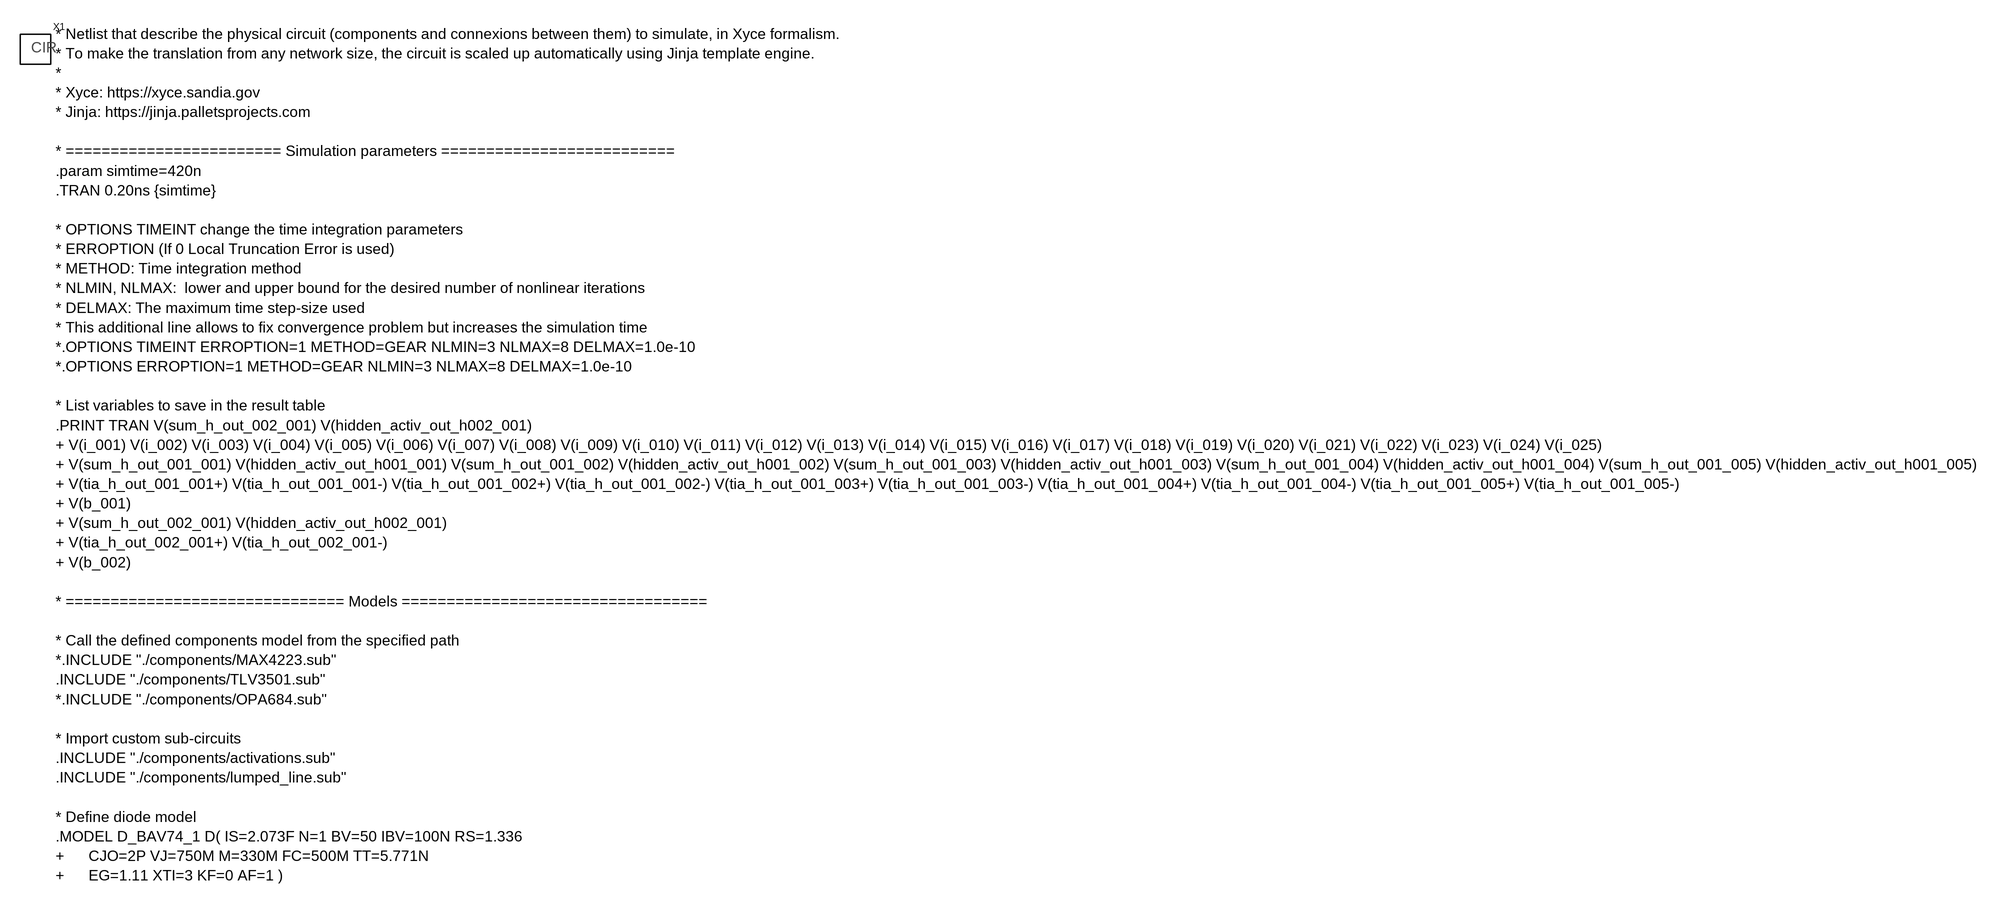
[diagram p0: schematic Draft1.asc]
Draft1.asc, the LTspice schematic file:
Version 4
SHEET 1 2360 680
SYMBOL netlist 928 -224 R0
SYMATTR InstName X1
TEXT 960 -248 Left 0 !* Netlist that describe the physical circuit (components and connexions between them) to simulate, in Xyce formalism.\n* To make the translation from any network size, the circuit is scaled up automatically using Jinja template engine.\n*\n* Xyce: https://xyce.sandia.gov\n* Jinja: https://jinja.palletsprojects.com\n \n* ======================== Simulation parameters ==========================\n.param simtime=420n\n.TRAN 0.20ns {simtime}\n \n* OPTIONS TIMEINT change the time integration parameters\n* ERROPTION (If 0 Local Truncation Error is used)\n* METHOD: Time integration method\n* NLMIN, NLMAX:  lower and upper bound for the desired number of nonlinear iterations\n* DELMAX: The maximum time step-size used\n* This additional line allows to fix convergence problem but increases the simulation time\n*.OPTIONS TIMEINT ERROPTION=1 METHOD=GEAR NLMIN=3 NLMAX=8 DELMAX=1.0e-10\n*.OPTIONS ERROPTION=1 METHOD=GEAR NLMIN=3 NLMAX=8 DELMAX=1.0e-10\n \n* List variables to save in the result table\n.PRINT TRAN V(sum_h_out_002_001) V(hidden_activ_out_h002_001)\n+ V(i_001) V(i_002) V(i_003) V(i_004) V(i_005) V(i_006) V(i_007) V(i_008) V(i_009) V(i_010) V(i_011) V(i_012) V(i_013) V(i_014) V(i_015) V(i_016) V(i_017) V(i_018) V(i_019) V(i_020) V(i_021) V(i_022) V(i_023) V(i_024) V(i_025)\n+ V(sum_h_out_001_001) V(hidden_activ_out_h001_001) V(sum_h_out_001_002) V(hidden_activ_out_h001_002) V(sum_h_out_001_003) V(hidden_activ_out_h001_003) V(sum_h_out_001_004) V(hidden_activ_out_h001_004) V(sum_h_out_001_005) V(hidden_activ_out_h001_005)\n+ V(tia_h_out_001_001+) V(tia_h_out_001_001-) V(tia_h_out_001_002+) V(tia_h_out_001_002-) V(tia_h_out_001_003+) V(tia_h_out_001_003-) V(tia_h_out_001_004+) V(tia_h_out_001_004-) V(tia_h_out_001_005+) V(tia_h_out_001_005-)\n+ V(b_001)\n+ V(sum_h_out_002_001) V(hidden_activ_out_h002_001)\n+ V(tia_h_out_002_001+) V(tia_h_out_002_001-)\n+ V(b_002)\n \n* =============================== Models ==================================\n \n* Call the defined components model from the specified path\n*.INCLUDE "./components/MAX4223.sub"\n.INCLUDE "./components/TLV3501.sub"\n*.INCLUDE "./components/OPA684.sub"\n \n* Import custom sub-circuits\n.INCLUDE "./components/activations.sub"\n.INCLUDE "./components/lumped_line.sub"\n \n* Define diode model\n.MODEL D_BAV74_1 D( IS=2.073F N=1 BV=50 IBV=100N RS=1.336\n+      CJO=2P VJ=750M M=330M FC=500M TT=5.771N\n+      EG=1.11 XTI=3 KF=0 AF=1 )

The netlist it stands for:
* Draft1.asc
XX1 "C:\Users\Hussein\UDeM\OneDrive - USherbrooke\circuits\XYCE\simulations\ActivationFunction\Sigmoid4_HA\LTspice-cli-master\LTspice-cli-master\test\netlist_copy.cir" crossbarTest crossbarTest
* Netlist that describe the physical circuit (components and connexions between them) to simulate, in Xyce formalism.
* To make the translation from any network size, the circuit is scaled up automatically using Jinja template engine.
*
* Xyce: https://xyce.sandia.gov
* Jinja: https://jinja.palletsprojects.com
* ======================== Simulation parameters ==========================
.param simtime=420n
.TRAN 0.20ns {simtime}
* OPTIONS TIMEINT change the time integration parameters
* ERROPTION (If 0 Local Truncation Error is used)
* METHOD: Time integration method
* NLMIN, NLMAX:  lower and upper bound for the desired number of nonlinear iterations
* DELMAX: The maximum time step-size used
* This additional line allows to fix convergence problem but increases the simulation time
*.OPTIONS TIMEINT ERROPTION=1 METHOD=GEAR NLMIN=3 NLMAX=8 DELMAX=1.0e-10
*.OPTIONS ERROPTION=1 METHOD=GEAR NLMIN=3 NLMAX=8 DELMAX=1.0e-10
* List variables to save in the result table
.PRINT TRAN V(sum_h_out_002_001) V(hidden_activ_out_h002_001)
+ V(i_001) V(i_002) V(i_003) V(i_004) V(i_005) V(i_006) V(i_007) V(i_008) V(i_009) V(i_010) V(i_011) V(i_012) V(i_013) V(i_014) V(i_015) V(i_016) V(i_017) V(i_018) V(i_019) V(i_020) V(i_021) V(i_022) V(i_023) V(i_024) V(i_025)
+ V(sum_h_out_001_001) V(hidden_activ_out_h001_001) V(sum_h_out_001_002) V(hidden_activ_out_h001_002) V(sum_h_out_001_003) V(hidden_activ_out_h001_003) V(sum_h_out_001_004) V(hidden_activ_out_h001_004) V(sum_h_out_001_005) V(hidden_activ_out_h001_005)
+ V(tia_h_out_001_001+) V(tia_h_out_001_001-) V(tia_h_out_001_002+) V(tia_h_out_001_002-) V(tia_h_out_001_003+) V(tia_h_out_001_003-) V(tia_h_out_001_004+) V(tia_h_out_001_004-) V(tia_h_out_001_005+) V(tia_h_out_001_005-)
+ V(b_001)
+ V(sum_h_out_002_001) V(hidden_activ_out_h002_001)
+ V(tia_h_out_002_001+) V(tia_h_out_002_001-)
+ V(b_002)
* =============================== Models ==================================
* Call the defined components model from the specified path
*.INCLUDE "./components/MAX4223.sub"
.INCLUDE "./components/TLV3501.sub"
*.INCLUDE "./components/OPA684.sub"
* Import custom sub-circuits
.INCLUDE "./components/activations.sub"
.INCLUDE "./components/lumped_line.sub"
* Define diode model
.MODEL D_BAV74_1 D( IS=2.073F N=1 BV=50 IBV=100N RS=1.336
+      CJO=2P VJ=750M M=330M FC=500M TT=5.771N
+      EG=1.11 XTI=3 KF=0 AF=1 )
.backanno
.end